# Altium schematic sheet Bluetooth.SchDoc
size A4
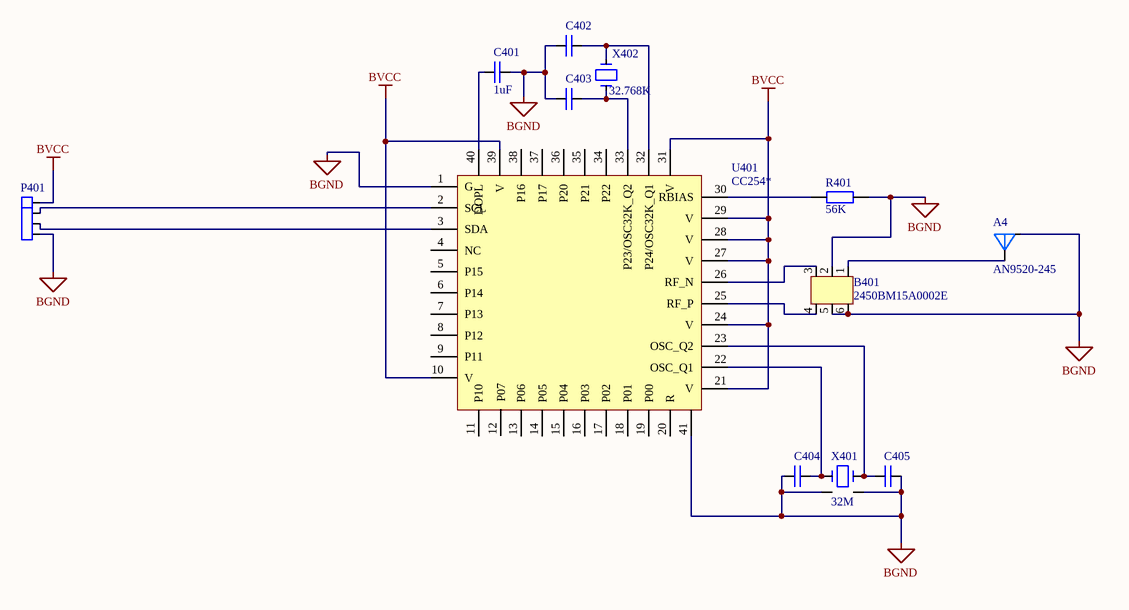
[diagram p0: Bluetooth.SchDoc]

## Parts
A4  AN9520-245  [AN9520-245]
B401  2450BM15A0002E  [2450BM15A0002]
C401  1uF  [0603]
C402  (no value)  [0603]
C403  (no value)  [0603]
C404  (no value)  [0603]
C405  (no value)  [0603]
P401  DIP_4  [DIP_4]  (value not drawn)
R401  56K  [0603]
U401  CC254*  [CC254x]
X401  32M  [3225]
X402  32.768K  [3215]

## Nets
BGND: A4.2 B401.2 B401.5 B401.6 C401.2 C402.1 C403.1 C404.1 C405.2 P401.4 R401.1 U401.1(G) U401.41 X401.2 X401.4
BVCC: P401.1 U401.10(V) U401.21(V) U401.24(V) U401.27(V) U401.28(V) U401.29(V) U401.31(V) U401.39(V)
NetA4_1: A4.1 B401.1
NetB401_3: B401.3 U401.26(RF_N)
NetB401_4: B401.4 U401.25(RF_P)
NetC401_1: C401.1 U401.40(DOPL)
NetC402_2: C402.2 U401.32(P24/OSC32K_Q1) X402.2
NetC403_2: C403.2 U401.33(P23/OSC32K_Q2) X402.1
NetC404_2: C404.2 U401.22(OSC_Q1) X401.1
NetC405_1: C405.1 U401.23(OSC_Q2) X401.3
NetP401_2: P401.2 U401.2(SCL)
NetP401_3: P401.3 U401.3(SDA)
NetR401_2: R401.2 U401.30(RBIAS)

Not connected (* = marked no-connect by the designer): U401 4(NC) 5(P15) 6(P14) 7(P13) 8(P12) 9(P11) 11(P10) 12(P07) 13(P06) 14(P05) 15(P04) 16(P03) 17(P02) 18(P01) 19(P00) 20(R) 34(P22) 35(P21) 36(P20) 37(P17) 38(P16)

## Library data of the parts
A4 = AN9520-245: antenna
B401 = 2450BM15A0002E: CC2541
C401-C405 = C0603
R401 = R0603
U401 = CC254x
X401 = X2: 3225
X402 = X3: 3215